# EAGLE design Power:Logic Board (EAGLE 7.6.0)
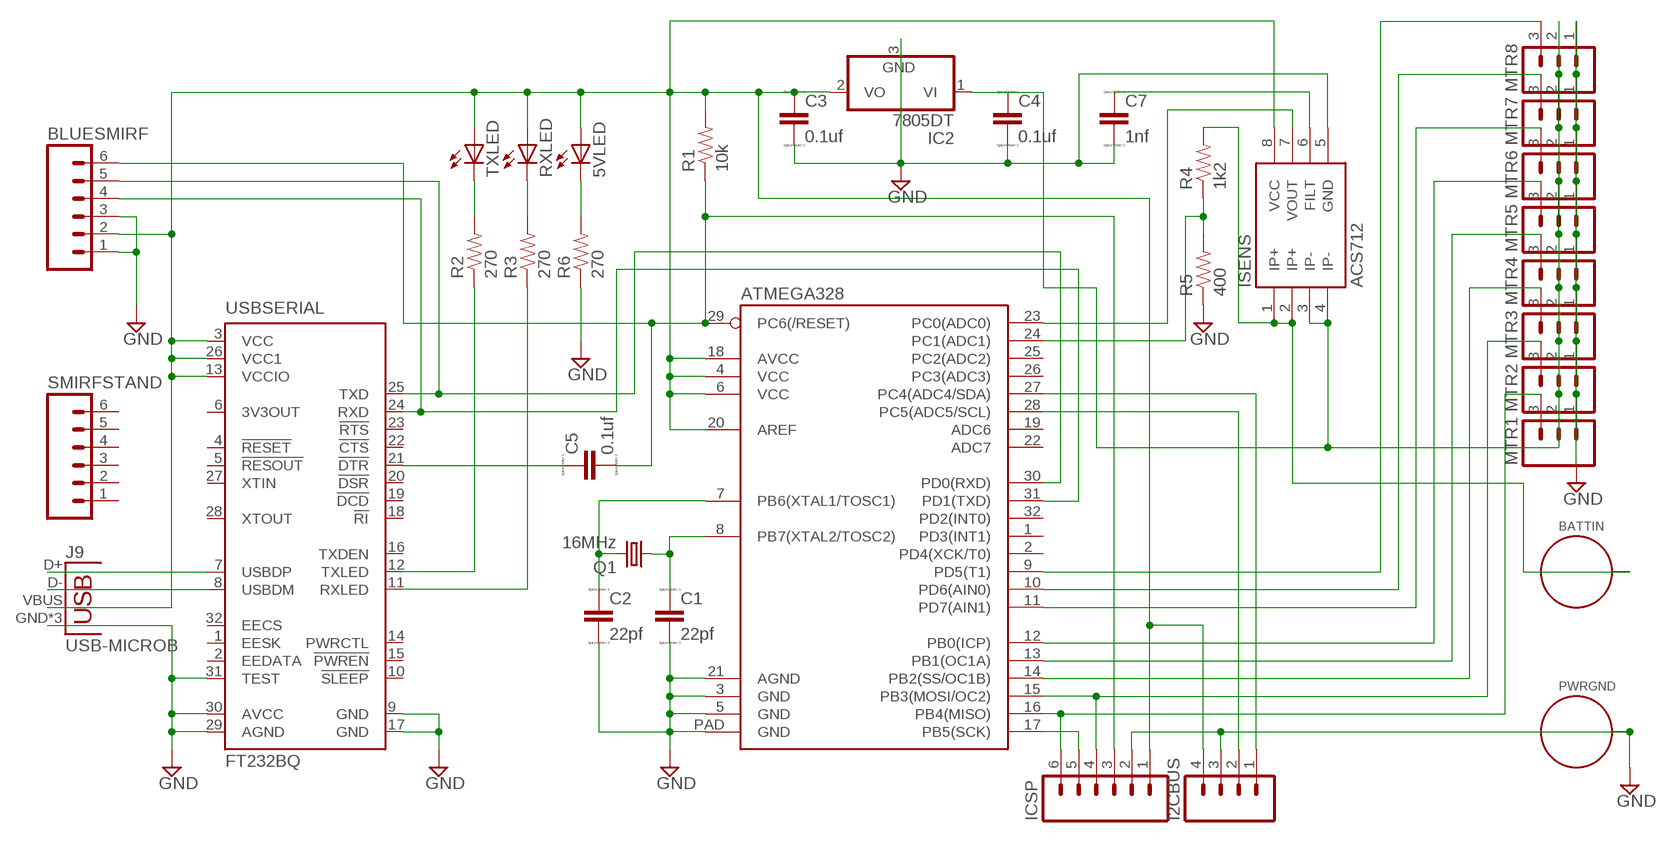
[diagram p0: schematic, sheet 1]

## Parts
5VLED  LEDCHIPLED_0805  [CHIPLED_0805]
ATMEGA328  ATMEGA328P_MLFMLF32  [MLF32-PAD]
BATTIN  STANDOFF_ELECTRICAL  [STANDOFF-ELECTRICAL]
BLUESMIRF  M06NO_SILK_YES_STOP  [1X06_NO_SILK_YES_STOP]
C1  22pf  C  [C0805]
C2  22pf  C  [C0805]
C3  0.1uf  C  [C0805]
C4  0.1uf  C  [C0805]
C5  0.1uf  C  [C0805]
C7  1nf  C  [C0805]
I2CBUS  M04NO_SILK_ALL_ROUND  [1X04_NO_SILK_ALL_ROUND]
IC2  7805DT  [TO252]
ICSP  M06NO_SILK_YES_STOP  [1X06_NO_SILK_YES_STOP]
ISENS  ACS712  [SO08]
J9  USB-MICROB  [USB-MICROB]
MTR1  M03PTH  [1X03]
MTR2  M03PTH  [1X03]
MTR3  M03PTH  [1X03]
MTR4  M03PTH  [1X03]
MTR5  M03PTH  [1X03]
MTR6  M03PTH  [1X03]
MTR7  M03PTH  [1X03]
MTR8  M03PTH  [1X03]
PWRGND  STANDOFF_ELECTRICAL  [STANDOFF-ELECTRICAL]
Q1  16MHz  CRYSTALHC49U-V  [HC49U-V]
R1  10k  RESISTOR0805-RES  [0805]
R2  270  RESISTOR0805-RES  [0805]
R3  270  RESISTOR0805-RES  [0805]
R4  1k2  RESISTOR0805-RES  [0805]
R5  400  RESISTOR0805-RES  [0805]
R6  270  RESISTOR0805-RES  [0805]
RXLED  LEDCHIPLED_0805  [CHIPLED_0805]
SMIRFSTAND  M06NO_SILK_YES_STOP  [1X06_NO_SILK_YES_STOP]
TXLED  LEDCHIPLED_0805  [CHIPLED_0805]
USBSERIAL  FT232BQ  [QFN32]

## Nets
GND: ATMEGA328.3(GND) ATMEGA328.5(GND) ATMEGA328.21(AGND) ATMEGA328.PAD(GND) BLUESMIRF.1 BLUESMIRF.3 C1.2 C2.2 C3.2 C4.2 C7.2 I2CBUS.3 IC2.3(GND) ICSP.2 ISENS.5(GND) J9.GND J9.MT1(GND) J9.MT2(GND) MTR1.1 MTR2.1 MTR3.1 MTR4.1 MTR5.1 MTR6.1 MTR7.1 MTR8.1 PWRGND.P1 R5.1 R6.1 USBSERIAL.9(GND) USBSERIAL.17(GND) USBSERIAL.29(AGND) USBSERIAL.30(AVCC) USBSERIAL.31(TEST)
N$1: J9.D+ USBSERIAL.7(USBDP)
N$2: ATMEGA328.31(PD1(TXD)) BLUESMIRF.4 USBSERIAL.24(RXD)
N$3: J9.D- USBSERIAL.8(USBDM)
N$4: 5VLED.A ATMEGA328.4(VCC) ATMEGA328.6(VCC) ATMEGA328.18(AVCC) ATMEGA328.20(AREF) BLUESMIRF.2 C3.1 I2CBUS.4 IC2.2(VO) ICSP.1 ISENS.8(VCC) J9.VBUS R1.2 RXLED.A TXLED.A USBSERIAL.3(VCC) USBSERIAL.13(VCCIO) USBSERIAL.26(VCC1)
N$5: ATMEGA328.14(PB2(SS/OC1B)) MTR3.3
N$6: ATMEGA328.23(PC0(ADC0)) ISENS.7(VOUT)
N$7: ATMEGA328.8(PB7(XTAL2/TOSC2)) C1.1 Q1.1
N$8: ATMEGA328.9(PD5(T1)) MTR8.3
N$9: ATMEGA328.13(PB1(OC1A)) MTR4.3
N$10: ATMEGA328.17(PB5(SCK)) ICSP.5
N$11: ATMEGA328.12(PB0(ICP)) MTR5.3
N$12: ATMEGA328.16(PB4(MISO)) ICSP.6 MTR1.3
N$13: ATMEGA328.15(PB3(MOSI/OC2)) ICSP.4 MTR2.3
N$14: R2.2 TXLED.C
N$15: ATMEGA328.7(PB6(XTAL1/TOSC1)) C2.1 Q1.2
N$16: R2.1 USBSERIAL.12(TXLED)
N$17: R3.2 RXLED.C
N$18: R3.1 USBSERIAL.11(RXLED)
N$19: ATMEGA328.11(PD7(AIN1)) MTR6.3
N$20: ATMEGA328.29(PC6(/RESET)) BLUESMIRF.6 C5.2 ICSP.3 R1.1
N$21: C7.1 ISENS.6(FILT)
N$22: C4.1 IC2.1(VI) ISENS.3(IP-) ISENS.4(IP-) MTR1.2 MTR2.2 MTR3.2 MTR4.2 MTR5.2 MTR6.2 MTR7.2 MTR8.2
N$23: ATMEGA328.24(PC1(ADC1)) R4.1 R5.2
N$24: ATMEGA328.10(PD6(AIN0)) MTR7.3
N$25: BATTIN.P1 ISENS.1(IP+) ISENS.2(IP+) R4.2
N$26: ATMEGA328.30(PD0(RXD)) BLUESMIRF.5 USBSERIAL.25(TXD)
N$27: C5.1 USBSERIAL.21(!DTR)
N$28: ATMEGA328.28(PC5(ADC5/SCL)) I2CBUS.2
N$29: ATMEGA328.27(PC4(ADC4/SDA)) I2CBUS.1
N$30: 5VLED.C R6.2
Unconnected: ATMEGA328.1(PD3(INT1)) ATMEGA328.2(PD4(XCK/T0)) ATMEGA328.19(ADC6) ATMEGA328.22(ADC7) ATMEGA328.25(PC2(ADC2)) ATMEGA328.26(PC3(ADC3)) ATMEGA328.32(PD2(INT0)) SMIRFSTAND.1 SMIRFSTAND.2 SMIRFSTAND.3 SMIRFSTAND.4 SMIRFSTAND.5 SMIRFSTAND.6 USBSERIAL.1(EESK) USBSERIAL.2(EEDATA) USBSERIAL.4(!RESET) USBSERIAL.5(!RESOUT) USBSERIAL.6(3V3OUT) USBSERIAL.10(!SLEEP) USBSERIAL.14(PWRCTL) USBSERIAL.15(!PWREN) USBSERIAL.16(TXDEN) USBSERIAL.18(!RI) USBSERIAL.19(!DCD) USBSERIAL.20(!DSR) USBSERIAL.22(!CTS) USBSERIAL.23(!RTS) USBSERIAL.27(XTIN) USBSERIAL.28(XTOUT) USBSERIAL.32(EECS)

## Library data of the parts
5VLED RXLED TXLED = led:LED: LED OSRAM: - CHIPLED LG R971, LG N971, LY N971, LG Q971, LY Q971, LO R971, LY R971 LH N974, LH R974 LS Q976, LO Q976, LY Q976 LO Q996 - Hyper CHIPLED LW Q18S LB Q993, LB Q99A, LB R99A - SideLED LS A670, LO A670, LY A670, LG A670, LP A670 LB A673, LV A673, LT A673, LW A673 LH A674 LY A675 LS A676, LA A676, LO A676, LY A676, LW A676 LS A679, LY A679, LG A679 - Hyper Micro SIDELED® LS Y876, LA Y876, LO Y876, LY Y876 LT Y87S - SmartLED LW L88C, LW L88S LB L89C, LB L89S, LG L890 LS L89K, LO L89K, LY L89K LS L896, LA L896, LO L896, LY L896 - TOPLED LS T670, LO T670, LY T670, LG T670, LP T670 LSG T670, LSP T670, LSY T670, LOP T670, LYG T670 LG T671, LOG T671, LSG T671 LB T673, LV T673, LT T673, LW T673 LH T674 LS T676, LA T676, LO T676, LY T676, LB T676, LH T676, LSB T676, LW T676 LB T67C, LV T67C, LT T67C, LS T67K, LO T67K, LY T67K, LW E67C LS E67B, LA E67B, LO E67B, LY E67B, LB E67C, LV E67C, LT E67C LW T67C LS T679, LY T679, LG T679 LS T770, LO T770, LY T770, LG T770, LP T770 LB T773, LV T773, LT T773, LW T773 LH T774 LS E675, LA E675, LY E675, LS T675 LS T776, LA T776, LO T776, LY T776, LB T776 LHGB T686 LT T68C, LB T68C - Hyper Mini TOPLED® LB M676 - Mini TOPLED Santana® LG M470 LS M47K, LO M47K, LY M47K Source: http://www.osram.convergy.de LUXEON: - LUMILED® LXK2-PW12-R00, LXK2-PW12-S00, LXK2-PW14-U00, LXK2-PW14-V00 LXK2-PM12-R00, LXK2-PM12-S00, LXK2-PM14-U00 LXK2-PE12-Q00, LXK2-PE12-R00, LXK2-PE12-S00, LXK2-PE14-T00, LXK2-PE14-U00 LXK2-PB12-K00, LXK2-PB12-L00, LXK2-PB12-M00, LXK2-PB14-N00, LXK2-PB14-P00, LXK2-PB14-Q00 LXK2-PR12-L00, LXK2-PR12-M00, LXK2-PR14-Q00, LXK2-PR14-R00 LXK2-PD12-Q00, LXK2-PD12-R00, LXK2-PD12-S00 LXK2-PH12-R00, LXK2-PH12-S00 LXK2-PL12-P00, LXK2-PL12-Q00, LXK2-PL12-R00 Source: www.luxeon.com KINGBRIGHT: KA-3528ASYC Source: www.kingbright.com
ATMEGA328 = SparkFun-DigitalIC:ATMEGA328P_MLF: 32-Pin Atmega328 part Commonly used on Arduino compatible boards Available in QFP and QFN packages TQFP is IC-09069 QFN is non-stock
BATTIN PWRGND = SparkFun-Electromechanical:STANDOFF_ELECTRICAL: A standoff intended to be an electrically connected point. Pad size and stop size allow for a #4 Phillips pan screw head to make a solid connection to the board.
BLUESMIRF ICSP SMIRFSTAND = SparkFun-Connectors:M06: Header 6 Standard 6-pin 0.1" header. Use with straight break away headers (SKU : PRT-00116), right angle break away headers (PRT-00553), swiss pins (PRT-00743), machine pins (PRT-00117), and female headers (PRT-00115). Molex polarized connector foot print use with SKU : PRT-08094 with associated crimp pins and housings. NOTES ON THE VARIANTS LOCK and LOCK_LONGPADS... This footprint was designed to help hold the alignment of a through-hole component (i.e. 6-pin header) while soldering it into place. You may notice that each hole has been shifted either up or down by 0.005 of an inch from it's more standard position (which is a perfectly straight line). This slight alteration caused the pins (the squares in the middle) to touch the edges of the holes. Because they are alternating, it causes a "brace" to hold the component in place. 0.005 has proven to be the perfect amount of "off-center" position when using our standard breakaway headers. Although looks a little odd when you look at the bare footprint, once you have a header in there, the alteration is very hard to notice. Also,if you push a header all the way into place, it is covered up entirely on the bottom side. This idea of altering the position of holes to aid alignment will be further integrated into the Sparkfun Library for other footprints. It can help hold any component with 3 or more connection pins.
C1-C5 C7 = eagle-ltspice:C: CAPACITOR, European symbol; SPICEMODEL: NONE; SPICEPREFIX: C
I2CBUS = SparkFun-Connectors:M04: Header 4 Standard 4-pin 0.1" header. Use with straight break away headers (SKU : PRT-00116), right angle break away headers (PRT-00553), swiss pins (PRT-00743), machine pins (PRT-00117), and female headers (PRT-00115). Molex polarized connector foot print use with SKU : PRT-08231 with associated crimp pins and housings. 1MM SMD Version SKU: PRT-10208; PROD_ID: CONN-09696
IC2 = linear:78*: Positive VOLTAGE REGULATOR Source: http://cache.national.com/ds/LM/LM78L05.pdf http://www.fairchildsemi.com/ds/LM/LM7805.pdf
ISENS = SparkFun-AnalogIC:ACS712: Hall-effect-based isolated linear current sensor; PROD_ID: IC-08964
J9 = SparkFun-Connectors:USB: USB Connectors USB-B-PTH is fully proven SKU : PRT-00139/CONN-08278 USB-miniB is fully proven SKU : PRT-00587 USB-A-PCB is untested. USB-A-H is throughly reviewed, but untested. Spark Fun Electronics SKU : PRT-00437 USB-B-SMT is throughly reviewed, but untested. Needs silkscreen touching up. USB-A-S has not been used/tested USB-MB-H has not been used/tested USB-MICROB has been used. CONN-09505; PROD_ID: CONN-09505
MTR1-MTR8 = SparkFun-Connectors:M03: Header 3 Standard 3-pin 0.1" header. Use with straight break away headers (SKU : PRT-00116), right angle break away headers (PRT-00553), swiss pins (PRT-00743), machine pins (PRT-00117), and female headers (PRT-00115). Molex polarized connector foot print use with SKU : PRT-08232 with associated crimp pins and housings.
Q1 = crystal:CRYSTAL: CRYSTAL; OC_FARNELL: 1666969; OC_NEWARK: unknown
R1-R6 = SparkFun-Passives:RESISTOR: Resistor Basic schematic elements and footprints for 0603, 1206, and PTH resistors.
USBSERIAL = ftdichip:FT232B: USB to serial UART interface Source: DS_FT232BL_BQ.pdf; OC_FARNELL: unknown; OC_NEWARK: unknown

## Board
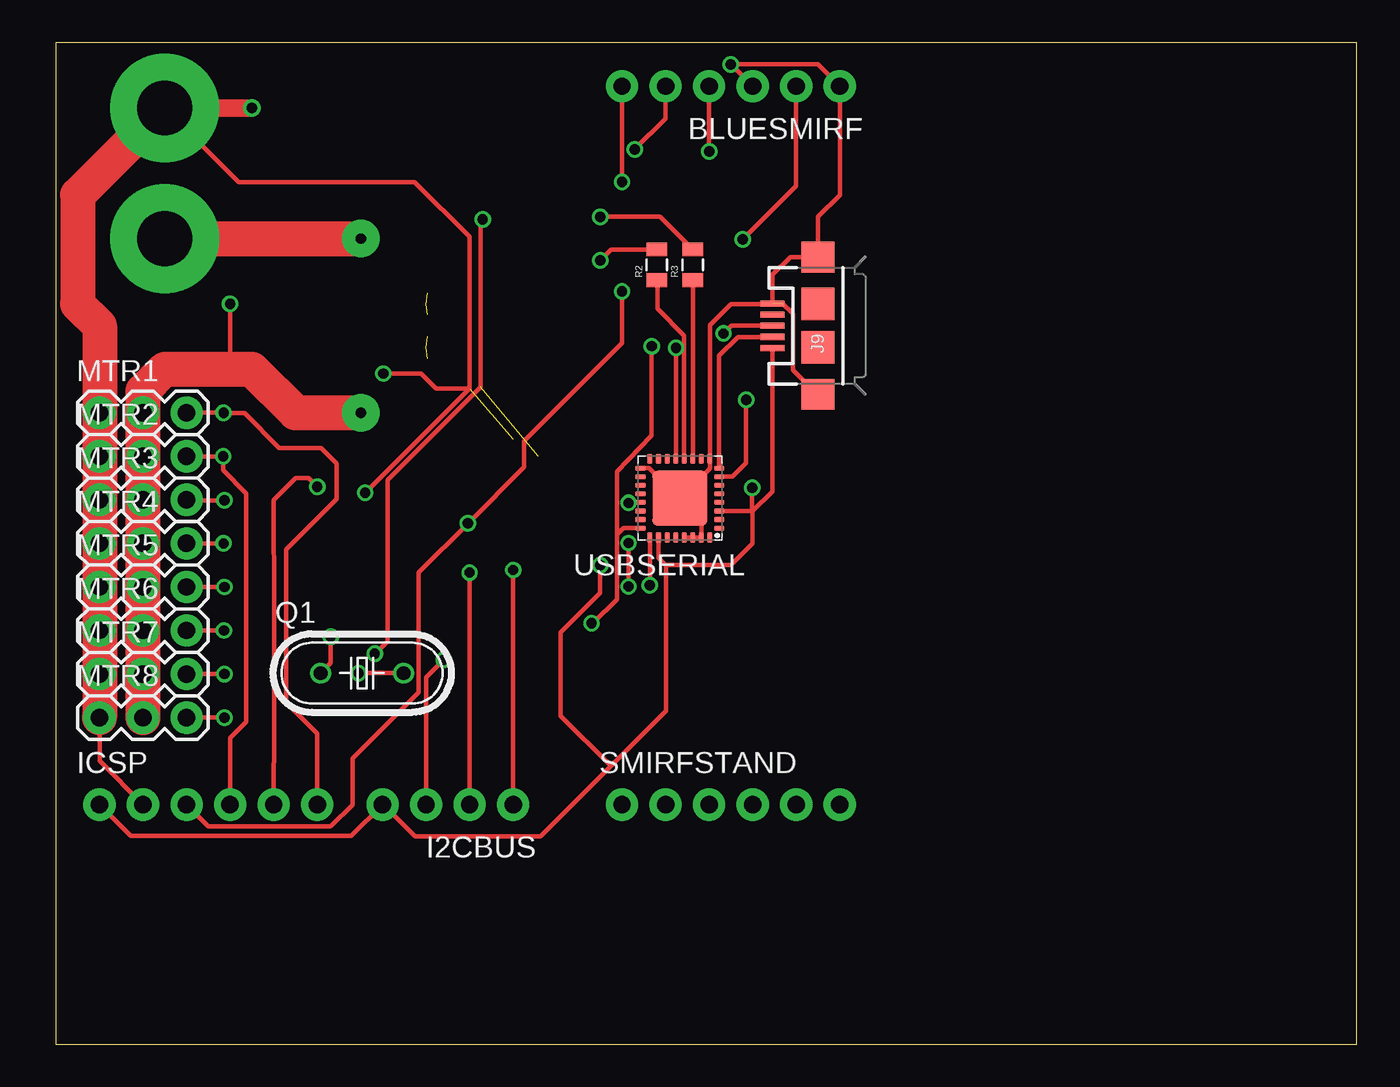
[diagram p1: board, top side]
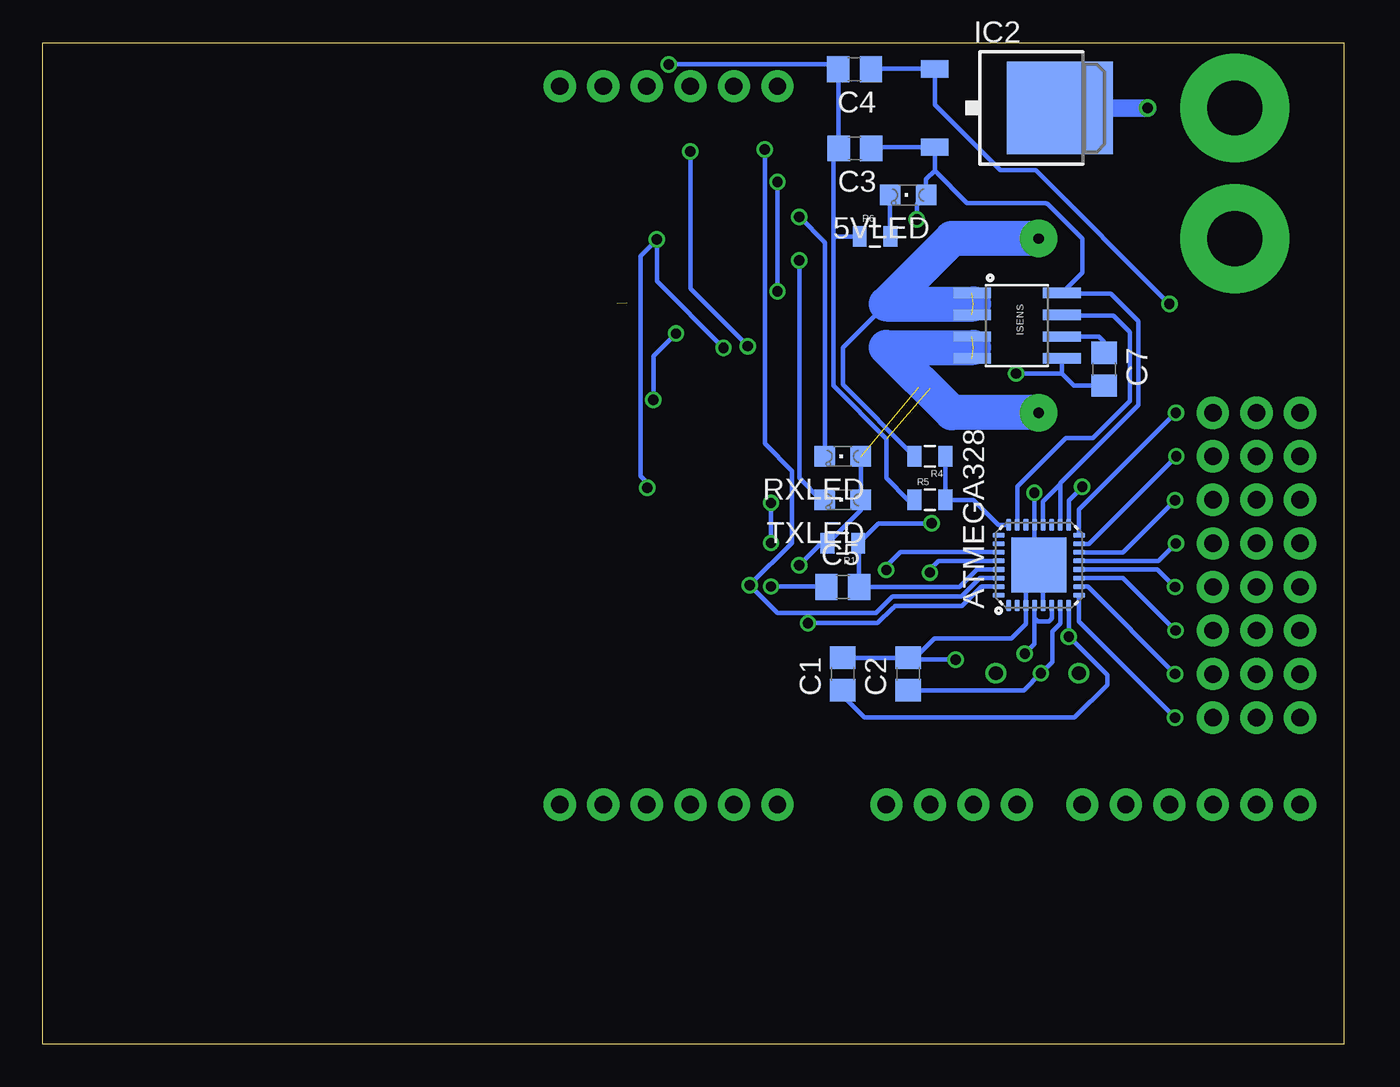
[diagram p2: board, bottom side, seen from below]

Size 75.87 x 58.41 mm. Coordinates in mm from the lower left corner, seen from the top.
Outline: 0,0 75.87,0 75.87,58.41 0,58.41 0,0
Copper layers (1*16): Top 0.0356mm / dielectric 1.5011mm / Bottom 0.0356mm
Design rules "oshpark-2layer": minimum track width 6mil, minimum drill 13mil, track to track 6mil, track to pad 6mil, pad to pad 6mil, via to via 6mil, smd to smd 6mil, copper to edge 15mil, drill to drill 6mil, minimum pad ring 7mil, minimum via ring 7mil, stop-mask expansion 2.5mil, vias tented up to drill 0mil, thermal gap 10mil

### Footprints (pad centres in the part's own frame; a part is rotated, then mirrored left to right if it is on the bottom)
CHIPLED_0805 = smd 1.2 x 1.2: A 0,-1.05; C 0,1.05
MLF32-PAD = smd 0.7 x 0.3: 1 -2.35,1.75; 2 -2.35,1.25; 3 -2.35,0.75; 4 -2.35,0.25; 5 -2.35,-0.25; 6 -2.35,-0.75; 7 -2.35,-1.25; 8 -2.35,-1.75; 17 2.35,-1.75; 18 2.35,-1.25; 19 2.35,-0.75; 20 2.35,-0.25; 21 2.35,0.25; 22 2.35,0.75; 23 2.35,1.25; 24 2.35,1.75 | smd 0.3 x 0.7: 9 -1.75,-2.35; 10 -1.25,-2.35; 11 -0.75,-2.35; 12 -0.25,-2.35; 13 0.25,-2.35; 14 0.75,-2.35; 15 1.25,-2.35; 16 1.75,-2.35; 25 1.75,2.35; 26 1.25,2.35; 27 0.75,2.35; 28 0.25,2.35; 29 -0.25,2.35; 30 -0.75,2.35; 31 -1.25,2.35; 32 -1.75,2.35 | smd 3.2 x 3.2: PAD 0,0
STANDOFF-ELECTRICAL = drill 3.2 pad 6.35: P1 0,0
1X06_NO_SILK_YES_STOP = drill 1.016 pad 1.88: 1 0,0; 2 2.54,0; 3 5.08,0; 4 7.62,0; 5 10.16,0; 6 12.7,0
C0805 = smd 1.3 x 1.5: 1 -0.95,0; 2 0.95,0
1X04_NO_SILK_ALL_ROUND = drill 1.016 pad 1.88: 1 0,0; 2 2.54,0; 3 5.08,0; 4 7.62,0
TO252 = smd 1 x 1.6: 1 -2.28,-4.8; 2 2.28,-4.8 | smd 5.4 x 6.2: 3 0,2.5
SO08 = smd 0.61 x 2.21: 1 -1.905,-2.616; 2 -0.635,-2.616; 3 0.635,-2.616; 4 1.905,-2.616; 5 1.905,2.616; 6 0.635,2.616; 7 -0.635,2.616; 8 -1.905,2.616
USB-MICROB = smd 0.35 x 1.4: D+ 0,2.65; D- -0.65,2.65; GND 1.3,2.65; ID 0.65,2.65; VBUS -1.3,2.65 | smd 1.8 x 1.9: MT1 -4,0; MT2 4,0 | smd 1.9 x 1.9: P$1 -1.27,0; P$2 1.27,0
1X03 = drill 1.016 pad 1.88: 1 0,0; 2 2.54,0; 3 5.08,0
HC49U-V = drill 0.813: 1 -2.413,0; 2 2.413,0
0805 = smd 0.8 x 1.2: 1 -0.9,0; 2 0.9,0
QFN32 = smd 0.6 x 0.3: 1 -2.3,1.75; 2 -2.3,1.25; 3 -2.3,0.75; 4 -2.3,0.25; 5 -2.3,-0.25; 6 -2.3,-0.75; 7 -2.3,-1.25; 8 -2.3,-1.75; 17 2.3,-1.75; 18 2.3,-1.25; 19 2.3,-0.75; 20 2.3,-0.25; 21 2.3,0.25; 22 2.3,0.75; 23 2.3,1.25; 24 2.3,1.75 | smd 0.3 x 0.6: 9 -1.75,-2.3; 10 -1.25,-2.3; 11 -0.75,-2.3; 12 -0.25,-2.3; 13 0.25,-2.3; 14 0.75,-2.3; 15 1.25,-2.3; 16 1.75,-2.3; 25 1.75,2.3; 26 1.25,2.3; 27 0.75,2.3; 28 0.25,2.3; 29 -0.25,2.3; 30 -0.75,2.3; 31 -1.25,2.3; 32 -1.75,2.3 | smd 3.2 x 3.2: EXP 0,0

### Placement (x,y rotation side)
5VLED  25.4,49.53 90 bottom
ATMEGA328  17.78,27.94 90 bottom
BATTIN  6.35,46.99 0 top
BLUESMIRF  45.72,55.88 180 top
C1  29.21,21.59 90 bottom
C2  25.4,21.59 90 bottom
C3  28.5,52.25 180 bottom
C4  28.52,56.87 180 bottom
C5  29.21,26.67 0 bottom
C7  13.97,39.37 270 bottom
I2CBUS  26.67,13.97 180 top
IC2  19.05,54.61 270 bottom
ICSP  2.54,13.97 0 top
ISENS  19.05,41.91 270 bottom
J9  44.45,41.91 90 top
MTR1  2.54,36.83 0 top
MTR2  2.54,34.29 0 top
MTR3  2.54,31.75 0 top
MTR4  2.54,29.21 0 top
MTR5  2.54,26.67 0 top
MTR6  2.54,24.13 0 top
MTR7  2.54,21.59 0 top
MTR8  2.54,19.05 0 top
PWRGND  6.35,54.61 0 top
Q1  17.86,21.64 0 top
R1  29.21,29.21 180 bottom
R2  35.05,45.47 90 top
R3  37.13,45.47 90 top
R4  24.13,34.29 180 bottom
R5  24.13,31.75 0 bottom
R6  27.33,47.12 0 bottom
RXLED  29.21,34.29 90 bottom
SMIRFSTAND  33.02,13.97 0 top
TXLED  29.21,31.75 90 bottom
USBSERIAL  36.4,31.85 180 top

### Tracks (layer width: path | path; a pad name or v marks a point on that pad's centre or on a via)
GND  (via drill 0.6, 0.6 pad 1.02)  (2 unrouted)
  Top 0.254: 2.54,19.02 MTR8.1 2.54,16.51 ICSP.2 | v18.03,32.16 24.13,38.25 | 24.13,38.25 24.13,47.09 20.93,50.29 10.67,50.29 PWRGND.P1 | 24.13,38.25 22.17,38.25 21.31,39.12 v19.1,39.12 | I2CBUS.3 21.59,21.39 v22.63,22.43 | USBSERIAL.29 USBSERIAL.30 USBSERIAL.31 37.64,33.07 | J9.MT1 44.39,37.91 42.98,39.32 42.98,42.62 42.39,43.2 | 37.64,33.07 38.15,33.58 USBSERIAL.9 38.15,41.96 39.37,43.18 41.77,43.18 J9.GND 41.81,44.88 42.84,45.91 J9.MT2 44.45,48.26 45.72,49.53 BLUESMIRF.1 44.45,57.15 v39.37,57.15 BLUESMIRF.3 | USBSERIAL.17 34.6,33.6 35.13,33.07 37.64,33.07
  Top 1.016: v11.43,54.61 PWRGND.P1
  Top 2.032: PWRGND.P1 1.27,49.53 1.27,43.18 2.54,41.91 MTR1.1 MTR2.1 MTR3.1 MTR4.1 MTR5.1 MTR6.1 MTR7.1 MTR8.1
  Bottom 0.254: C2.2 C1.2 | ISENS.5 16.43,39.12 | 16.43,39.12 15.72,38.41 13.98,38.41 C7.2 | ATMEGA328.5 17.55,25.61 17.55,26.67 17.78,26.9 17.78,27.15 | C2.2 25.01,22.54 23.88,23.67 19.38,23.67 18.54,24.51 18.54,25.58 ATMEGA328.3 18.54,25.6 18.54,26.39 17.78,27.15 | v18.03,32.16 ATMEGA328.21 18.03,29.23 18.01,29.21 17.78,29.21 ATMEGA328.PAD 17.78,27.15 | R5.1 25.4,31.75 26.67,33.02 26.67,35.31 29.77,38.41 29.77,46.99 | 29.77,46.99 29.77,51.93 C3.2 29.47,52.27 C4.2 29.75,57.15 v39.37,57.15 | R6.1 29.64,47.12 29.77,46.99 | v19.1,39.12 16.43,39.12 | v22.63,22.43 25.29,22.43 C2.2
  Bottom 1.016: IC2.3 v11.43,54.61
N$1  (via drill 0.6)
  Top 0.254: USBSERIAL.7 39.45,33.1 40.26,33.91 v40.26,37.59 | v38.94,41.45 39.4,41.91 J9.D+
  Bottom 0.254: v40.26,37.59 40.26,40.13 v38.94,41.45
N$2  (via drill 0.6)
  Top 0.254: v31.24,24.56 31.34,24.56 32.72,25.93 32.72,29.44 32.72,29.72 | 32.72,29.72 33.1,30.1 USBSERIAL.24 | BLUESMIRF.4 v38.1,52.07 | v34.75,40.72 34.75,35.51 32.72,33.4 32.72,29.72
  Bottom 0.254: ATMEGA328.31 21.11,26.69 22.25,25.55 26.16,25.55 26.26,25.45 26.29,25.45 27.18,24.56 v31.24,24.56 | v38.1,52.07 38.1,44.07 v34.75,40.72
N$3
  Top 0.254: J9.D- 39.79,41.26 38.68,40.16 38.68,33.62 USBSERIAL.8
N$4  (via drill 0.6)  (1 unrouted)
  Top 0.254: v18.59,22.78 18.64,22.78 19.36,23.5 19.36,32.92 24.77,38.33 24.77,47.98 v24.89,48.11 | J9.VBUS 41.8,32.25 40.64,31.09 | 40.64,31.09 USBSERIAL.3 40.62,31.1 v40.62,32.46 | USBSERIAL.26 35.15,28.35 35.56,27.94 | 35.56,27.94 39.37,27.94 40.64,29.21 40.64,31.09 | BLUESMIRF.2 43.18,50.06 v40.06,46.94 | v36.17,40.62 36.17,34.17 USBSERIAL.13 | ICSP.1 4.37,12.14 17.22,12.14 I2CBUS.4 19.1,13.97 20.95,12.12 28.27,12.12 32.37,16.22 | 32.37,16.22 35.59,19.43 35.59,27.91 35.56,27.94 | v31.75,27.94 31.75,26.31 31.73,26.31 29.44,24.03 29.44,19.15 32.37,16.22
  Bottom 0.254: C3.1 27.47,52.33 IC2.2 23.85,50.95 | 23.85,50.95 21.97,49.07 17.37,49.07 17.32,49.02 17.27,49.02 15.24,46.99 15.24,45.01 ISENS.8 16.41,43.79 13.59,43.79 11.96,42.16 11.96,37.29 16.51,32.74 | 16.51,32.74 16.53,32.72 ATMEGA328.18 | ATMEGA328.20 17.53,31.65 16.51,32.66 16.51,32.74 | ATMEGA328.6 17.02,25.58 17.02,24.84 17.2,24.66 17.83,24.66 18.03,24.86 ATMEGA328.4 18.03,23.35 v18.59,22.78 | 23.85,50.95 24.35,50.45 5VLED.A 24.89,48.99 v24.89,48.11 | RXLED.A TXLED.A 28.16,31.16 R1.2 30.48,29.21 v31.75,27.94 | v36.17,40.62 40.06,44.5 v40.06,46.94 41.02,45.97 41.02,33.15 40.62,32.74 v40.62,32.46
N$5  (via drill 0.6)
  Top 0.254: v9.83,31.73 7.64,31.73 MTR3.3
  Bottom 0.254: ATMEGA328.14 12.86,28.69 v9.83,31.73
N$6
  Bottom 0.254: ISENS.7 16.38,42.49 13.44,42.49 12.47,41.53 12.47,37.52 14.63,35.36 16.2,35.36 19.03,32.53 ATMEGA328.23
N$7  (via drill 0.6)
  Top 0.254: v16.03,23.77 16.03,22.23 Q1.1
  Bottom 0.254: ATMEGA328.8 v16.03,23.78 v16.03,23.77 13.79,21.54 13.79,20.95 15.7,19.05 27.94,19.05 29.21,20.32 C1.1
N$8  (via drill 0.6)
  Top 0.254: v9.83,19.05 MTR8.3
  Bottom 0.254: ATMEGA328.9 15.43,24.65 v9.83,19.05
N$9  (via drill 0.6)
  Top 0.254: v9.78,29.21 MTR4.3
  Bottom 0.254: ATMEGA328.13 10.8,28.19 v9.78,29.21
N$10  (via drill 0.6)
  Top 0.254: v15.24,32.51 14.73,33.02 13.97,33.02 12.7,31.75 12.7,29.21 12.72,27.86 12.72,16.43 12.7,16.41 ICSP.5
  Bottom 0.254: ATMEGA328.17 16.03,31.7 15.24,32.49 v15.24,32.51
N$11  (via drill 0.6)
  Top 0.254: v9.83,26.67 MTR5.3
  Bottom 0.254: ATMEGA328.12 10.85,27.69 v9.83,26.67
N$12  (via drill 0.6)
  Top 0.254: MTR1.3 v9.78,36.83 9.8,36.8 11,36.8 13.03,34.77 15.47,34.77 16.38,33.86 16.38,31.8 13.44,28.85 13.44,19.94 15.24,18.14 ICSP.6
  Bottom 0.254: ATMEGA328.16 15.43,31.18 v9.78,36.83
N$13  (via drill 0.6)
  Top 0.254: MTR2.3 v9.75,34.29 9.75,33.48 11.1,32.13 11.1,18.8 10.16,17.86 ICSP.4
  Bottom 0.254: ATMEGA328.15 14.85,29.19 v9.75,34.29
N$14  (via drill 0.6)
  Top 0.254: v31.75,45.72 32.38,46.35 35.04,46.35 R2.2
  Bottom 0.254: TXLED.C 30.48,31.75 31.75,33.02 v31.75,45.72
N$15  (via drill 0.6)
  Top 0.254: v17.65,21.64 Q1.2
  Bottom 0.254: ATMEGA328.7 16.53,24.54 16.99,24.08 16.99,22.3 v17.65,21.64 18.65,20.64 C2.1
N$16
  Top 0.254: USBSERIAL.12 36.65,41.33 35.08,42.9 35.08,44.54 R2.1
N$17  (via drill 0.6)
  Top 0.254: v31.75,48.26 35.24,48.26 R3.2
  Bottom 0.254: RXLED.C 30.26,46.77 v31.75,48.26
N$18
  Top 0.254: USBSERIAL.11 37.15,44.55 R3.1
N$19  (via drill 0.6)
  Top 0.254: v9.8,24.13 MTR6.3
  Bottom 0.254: ATMEGA328.11 12.86,27.19 v9.8,24.13
N$20  (via drill 0.6)
  Top 0.254: ICSP.3 8.89,12.7 16,12.7 16.03,12.72 16.05,12.72 17.3,13.97 17.3,16.66 21.16,20.52 21.16,27.51 v24.03,30.38 27.3,33.66 27.3,35.18 33.02,40.89 v33.02,43.92 | BLUESMIRF.6 v33.02,50.29
  Bottom 0.254: ATMEGA328.29 21.39,27.69 22.4,26.67 C5.2 28.26,29.16 R1.1 27.14,30.38 v24.03,30.38 | v33.02,50.29 v33.02,43.92
N$21
  Bottom 0.254: ISENS.6 14.28,41.27 13.97,40.97 C7.1
N$22  (via drill 0.6, 0.6 pad 2.18)  (2 unrouted)
  Top 0.254: v10.16,43.18 10.16,39.37
  Top 2.032: v17.78,36.83 13.97,36.83 11.43,39.37 10.16,39.37 6.35,39.37 5.08,38.1 MTR1.2 MTR2.2 MTR3.2 MTR4.2 MTR5.2 MTR6.2 MTR7.2 MTR8.2
  Bottom 0.254: C4.1 27.55,56.89 IC2.1 23.85,54.81 20.02,50.98 17.96,50.98 v10.16,43.18
  Bottom 2.032: v17.78,36.83 22.86,36.83 26.67,40.64 21.59,40.64
N$23
  Bottom 0.254: R4.1 R5.2 21.59,31.75 20.13,30.29 ATMEGA328.24
N$24  (via drill 0.6)
  Top 0.254: v9.83,21.59 MTR7.3
  Bottom 0.254: ATMEGA328.10 14.93,26.69 v9.83,21.59
N$25  (via drill 0.6 pad 2.18)  (2 unrouted)
  Top 2.032: BATTIN.P1 v17.78,46.99
  Bottom 0.254: R4.2 29.21,38.47 29.21,40.64 26.67,43.18
  Bottom 2.032: v17.78,46.99 22.86,46.99 26.67,43.18 21.59,43.18
N$26  (via drill 0.6)
  Top 0.254: v34.65,26.77 USBSERIAL.25 | BLUESMIRF.5 35.56,54 v33.76,52.2
  Bottom 0.254: ATMEGA328.30 21.22,27.19 22.3,26.11 26.31,26.11 27.28,25.15 33.02,25.15 v34.65,26.77 32.18,29.23 32.18,33.43 33.76,35.03 v33.76,52.2
N$27  (via drill 0.6)
  Top 0.254: USBSERIAL.21 33.43,31.6 v33.4,31.57 | v33.4,29.23 v33.4,26.7
  Bottom 0.254: v33.4,31.57 v33.4,29.23 | v33.4,26.7 30.18,26.7 C5.1
N$28  (via drill 0.6)
  Top 0.254: I2CBUS.2 v24.13,27.51
  Bottom 0.254: v24.13,27.51 24.13,27.71 23.65,28.19 ATMEGA328.28
N$29  (via drill 0.6)
  Top 0.254: I2CBUS.1 v26.67,27.66
  Bottom 0.254: v26.67,27.66 26.67,27.89 25.86,28.7 20.14,28.7 ATMEGA328.27
N$30
  Bottom 0.254: 5VLED.C 26.45,47.14 R6.2